# Altium schematic sheet PWR.SchDoc
size A; SheetNumber: 1; SheetTotal: 3
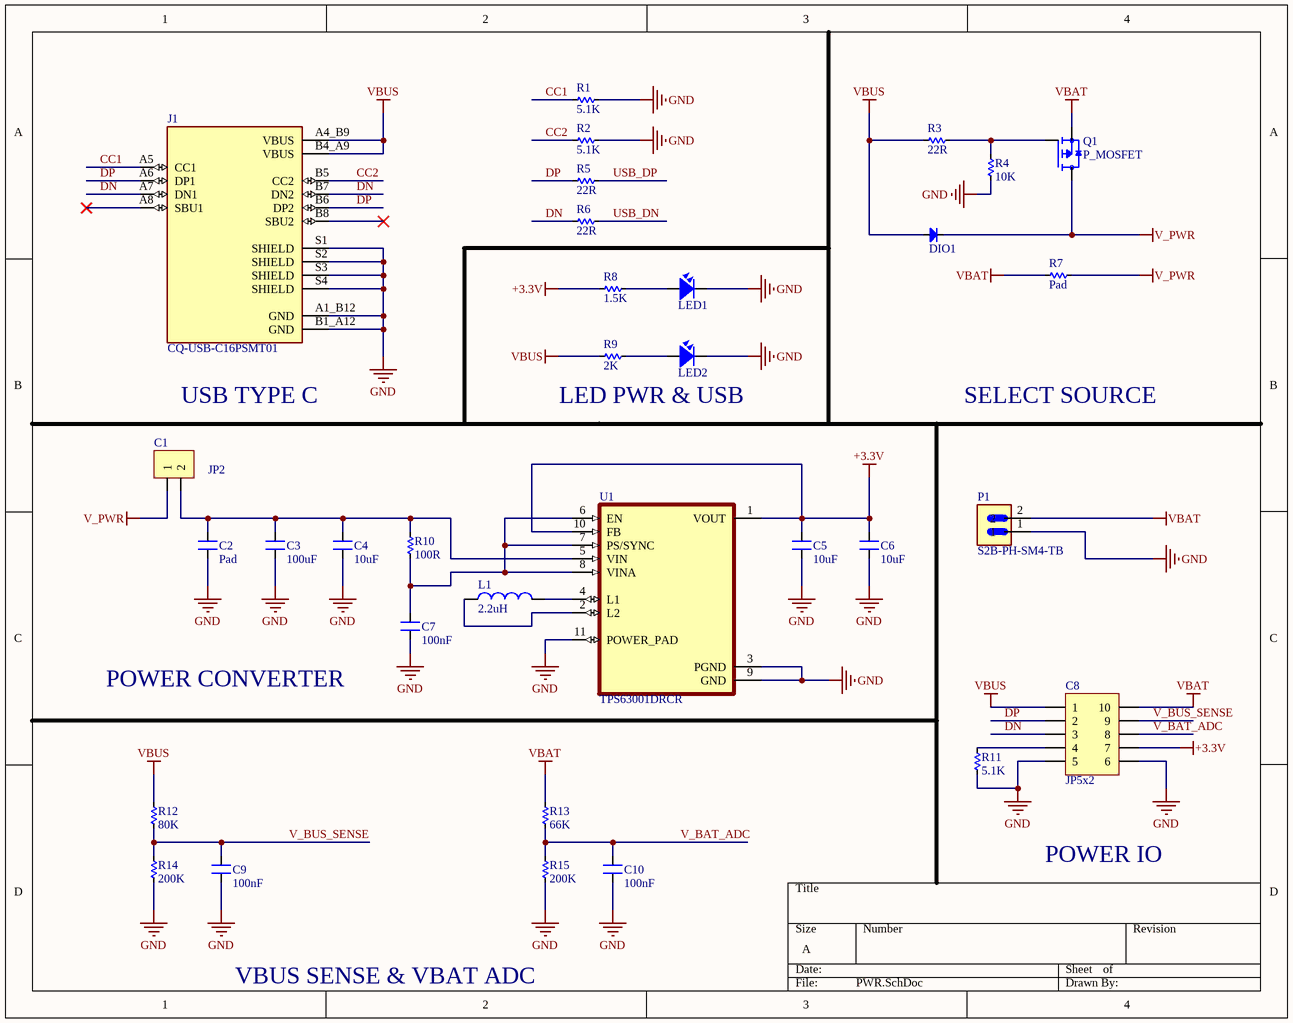
[diagram p0: PWR.SchDoc]

## Parts
C1  JP2  [JP2-CLOSED]
C2  Pad  [PAD-SMD-1206]
C3  100uF  [CN-SMD-1206]
C4  10uF  [CN-SMD-1206]
C5  10uF  [CN-SMD-1206]
C6  10uF  [CN-SMD-1206]
C7  100nF  [CN-SMD-0603]
C8  JP5x2  [JP5-D2T]
C9  100nF  [CN-SMD-0603]
C10  100nF  [CN-SMD-0603]
DIO1  Diode SMD  [DIO-SMD-123]  (value not drawn)
J1  CQ-USB-C16PSMT01  [SHENZHEN-CHUANGQIN-TECHNOLOGY_CQ-USB-C16PSMT01]
L1  2.2uH  [INDC6060X300]
LED1  LED GREEN  [LED-0805-Green]  (value not drawn)
LED2  LED GREEN  [LED-0805-Blue]  (value not drawn)
P1  S2B-PH-SM4-TB  [JST_S2B-PH-SM4-TB]
Q1  P_MOSFET  [P_MOSFET_SOT23]
R1  5.1K  [RES-SMD-0603]
R2  5.1K  [RES-SMD-0603]
R3  22R  [RES-SMD-0603]
R4  10K  [RES-SMD-0603]
R5  22R  [RES-SMD-0603]
R6  22R  [RES-SMD-0603]
R7  Pad  [PAD-SMD-1206]
R8  1.5K  [RES-SMD-0603]
R9  2K  [RES-SMD-0603]
R10  100R  [RES-SMD-0603]
R11  5.1K  [RES-SMD-0603]
R12  80K  [RES-SMD-0603]
R13  66K  [RES-SMD-0603]
R14  200K  [RES-SMD-0603]
R15  200K  [RES-SMD-0603]
U1  TPS63001DRCR  [VREG_V62/16624-01YE]

## Nets
+3.3V: C5.2 C6.2 C8.7 R8.2 U1.1(VOUT) U1.10(FB)
GND: C2.1 C3.1 C4.1 C5.1 C6.1 C7.1 C8.5 C8.6 C9.1 C10.1 J1.A1_B12(GND) J1.B1_A12(GND) J1.S1(SHIELD) J1.S2(SHIELD) J1.S3(SHIELD) J1.S4(SHIELD) LED1.2 LED2.2 P1.1 R1.1 R2.1 R4.2 R11.2 R14.1 R15.1 U1.3(PGND) U1.9(GND) U1.11(POWER_PAD)
V_PWR: C1.1 DIO1.2(K) Q1.3(D) R7.2
VBAT: C8.10 P1.2 Q1.2(S) R7.1 R13.2
VBUS: C8.1 DIO1.1(A) J1.A4_B9(VBUS) J1.B4_A9(VBUS) R3.2 R9.2 R12.2
CC1: J1.A5(CC1) R1.2
CC2: J1.B5(CC2) R2.2
DN: C8.3 J1.A7(DN1) J1.B7(DN2) R6.2
DP: C8.2 J1.A6(DP1) J1.B6(DP2) R5.2
USB_DN: R6.1
USB_DP: R5.1
V_BAT_ADC: C8.8 C10.2 R13.1 R15.2
V_BUS_SENSE: C8.9 C9.2 R12.1 R14.2
NetC1_2: C1.2 C2.2 C3.2 C4.2 R10.1 U1.5(VIN)
NetC7_2: C7.2 R10.2 U1.6(EN) U1.7(PS/SYNC) U1.8(VINA)
NetC8_4: C8.4 R11.1
NetL1_1: L1.1 U1.2(L2)
NetL1_2: L1.2 U1.4(L1)
NetLED1_1: LED1.1 R8.1
NetLED2_1: LED2.1 R9.1
NetQ1_1: Q1.1(G) R3.1 R4.1

Not connected (* = marked no-connect by the designer): J1 A8(SBU1)* B8(SBU2)*

## Notes on the sheet
- USB TYPE C
- LED PWR & USB
- SELECT SOURCE
- POWER CONVERTER
- POWER IO
- VBUS SENSE & VBAT ADC

## Library data of the parts
C1 = JP2: WR-PHD 2.54 mm Angled Socket Header; Manufacturer: W¨¹rth Elektronik eiSos GmbH; partNo: 613002143121; ComponentLink1 Description: Manufacturer; ComponentLink2 Description: Datasheet; NoPins: 02; Created Date: 29 March 2013; ComponentLink1URL: http://www.we-online.com; ComponentLink2URL: http://katalog.we-online.de/em/datasheet/6130xx143121.pdf; Created by: Karrer Zheng
C2-C7 C9 C10 = Cap-SMD: Value: 33pF
C8 = JP5x2: WR-PHD 2.54 mm Dual Socket Header; Manufacturer: W¨¹rth Elektronik eiSos GmbH; partNo: 61301021821; ComponentLink1 Description: Manufacturer; ComponentLink2 Description: Datasheet; NoPins: 10; Created Date: 29 March 2013; ComponentLink1URL: http://www.we-online.com; ComponentLink2URL: http://katalog.we-online.de/em/datasheet/6130xx21821.pdf; Created by: Karrer Zheng
DIO1 = Diode SMD: Default Diode; Code - JEDEC: DO-214-AB; Value: 1N5007; Published: 8-Jun-2000; Revision: July-2002: Re-released for DXP Platform.; Publisher: Altium Limited
J1 = CQ-USB-C16PSMT01: C Type USB Type-C Female Plug 16 Pin Connector Power Charger Jack Port; MF: Shenzen Chuangqin Technology; SnapEDA_Link: https://www.snapeda.com/parts/CQ-USB-C16PSMT01/Shenzen+Chuangqin+Technology/view-part/?ref=snap; Package: Package; Value: *; MP: CQ-USB-C16PSMT01; Check_prices: https://www.snapeda.com/parts/CQ-USB-C16PSMT01/Shenzen+Chuangqin+Technology/view-part/?ref=eda
L1 = SMD-Wire-Inductor: INDUCTOR wire-wound; MP: LQW2BAN68NG00L; Package: None; Price: None; Value: *; Availability: Unavailable
LED1 LED2 = LED SMD: Value: LED 3 - 5 ly 2 Colour
P1 = S2B-PH-SM4-TB: Connector Header Surface Mount, Right Angle 2 position 0.079 (2.00mm); MF: JST Sales; SnapEDA_Link: https://www.snapeda.com/parts/S2B-PH-SM4-TB/JST/view-part/?ref=snap; Package: None; Value: *; MP: S2B-PH-SM4-TB; Check_prices: https://www.snapeda.com/parts/S2B-PH-SM4-TB/JST/view-part/?ref=eda
Q1 = P_MOSFET: MF: Diotec Semiconductor; MP: MMFTP3401; SnapEDA_Link: https://www.snapeda.com/parts/MMFTP3401/Diotec/view-part/?ref=snap; Package: SOT-23 Diotec; Value: *; Check_prices: https://www.snapeda.com/parts/MMFTP3401/Diotec/view-part/?ref=eda
R1-R15 = Res-SMD: Resistor; Manufacturer: Generic Components; Class: Passive; Published: 08/06/2000; Publisher: Altium Hobart Technology Centre
U1 = TPS63001DRCR: 96% Buck-Boost Converter with 1.7A Current Switches, 3.3V fixed Output voltage in 3x3 QFN; MF: Texas Instruments; SnapEDA_Link: https://www.snapeda.com/parts/TPS63001DRCR/Texas+Instruments/view-part/?ref=snap; Package: VSON-10 Texas Instruments; Value: *; MP: TPS63001DRCR; Check_prices: https://www.snapeda.com/parts/TPS63001DRCR/Texas+Instruments/view-part/?ref=eda